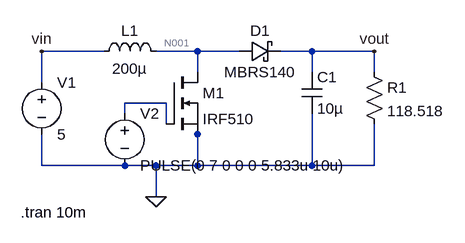
[diagram p0: schematic boost_converter.asc]
boost_converter.asc, the LTspice schematic file:
Version 4
SHEET 1 880 680
WIRE 144 64 48 64
WIRE 288 64 224 64
WIRE 352 64 288 64
WIRE 464 64 416 64
WIRE 560 64 464 64
WIRE 288 96 288 64
WIRE 464 96 464 64
WIRE 560 96 560 64
WIRE 48 112 48 64
WIRE 240 144 176 144
WIRE 176 160 176 144
WIRE 240 176 240 144
WIRE 288 192 288 176
WIRE 48 240 48 192
WIRE 176 240 48 240
WIRE 224 240 176 240
WIRE 288 240 288 192
WIRE 288 240 224 240
WIRE 464 240 464 160
WIRE 464 240 288 240
WIRE 560 240 560 176
WIRE 560 240 464 240
WIRE 224 288 224 240
FLAG 224 288 0
FLAG 560 64 vout
FLAG 48 64 vin
SYMBOL voltage 48 96 R0
WINDOW 123 0 0 Left 0
WINDOW 39 0 0 Left 0
SYMATTR InstName V1
SYMATTR Value 5
SYMBOL ind 128 80 R270
WINDOW 0 32 56 VTop 2
WINDOW 3 5 56 VBottom 2
SYMATTR InstName L1
SYMATTR Value 200µ
SYMBOL schottky 352 80 R270
WINDOW 0 32 32 VTop 2
WINDOW 3 0 32 VBottom 2
SYMATTR InstName D1
SYMATTR Value MBRS140
SYMATTR Description Diode
SYMATTR Type diode
SYMBOL cap 448 96 R0
SYMATTR InstName C1
SYMATTR Value 10µ
SYMBOL res 544 80 R0
SYMATTR InstName R1
SYMATTR Value 118.518
SYMBOL nmos 240 96 R0
SYMATTR InstName M1
SYMATTR Value IRF510
SYMBOL voltage 176 144 R0
WINDOW 123 0 0 Left 0
WINDOW 39 0 0 Left 0
SYMATTR InstName V2
SYMATTR Value PULSE(0 7 0 0 0 5.833u 10u)
TEXT 16 312 Left 2 !.tran 10m

The netlist it stands for:
* boost_converter.asc
V1 vin 0 5
L1 vin N001 200µ
D1 N001 vout MBRS140
C1 vout 0 10µ
R1 vout 0 118.518
M1 N001 N002 0 0 IRF510
V2 N002 0 PULSE(0 7 0 0 0 5.833u 10u)
.model D D
.lib standard.dio
.model NMOS NMOS
.model PMOS PMOS
.lib standard.mos
.tran 10m
.backanno
.end

* Results of the author's LTspice run, read from the files saved beside the schematic
* Operating Point, zero values left out:
*   V(vin) = 5 V
*   V(n001) = 5 V
*   V(vout) = 4.754 V
*   Id(M1) = 22 pA
*   Is(M1) = -22 pA
*   I(D1) = 40.11 mA
*   I(L1) = 40.11 mA
*   I(R1) = 40.11 mA
*   I(V1) = -40.11 mA